# EAGLE design EarButton (EAGLE 6.4)
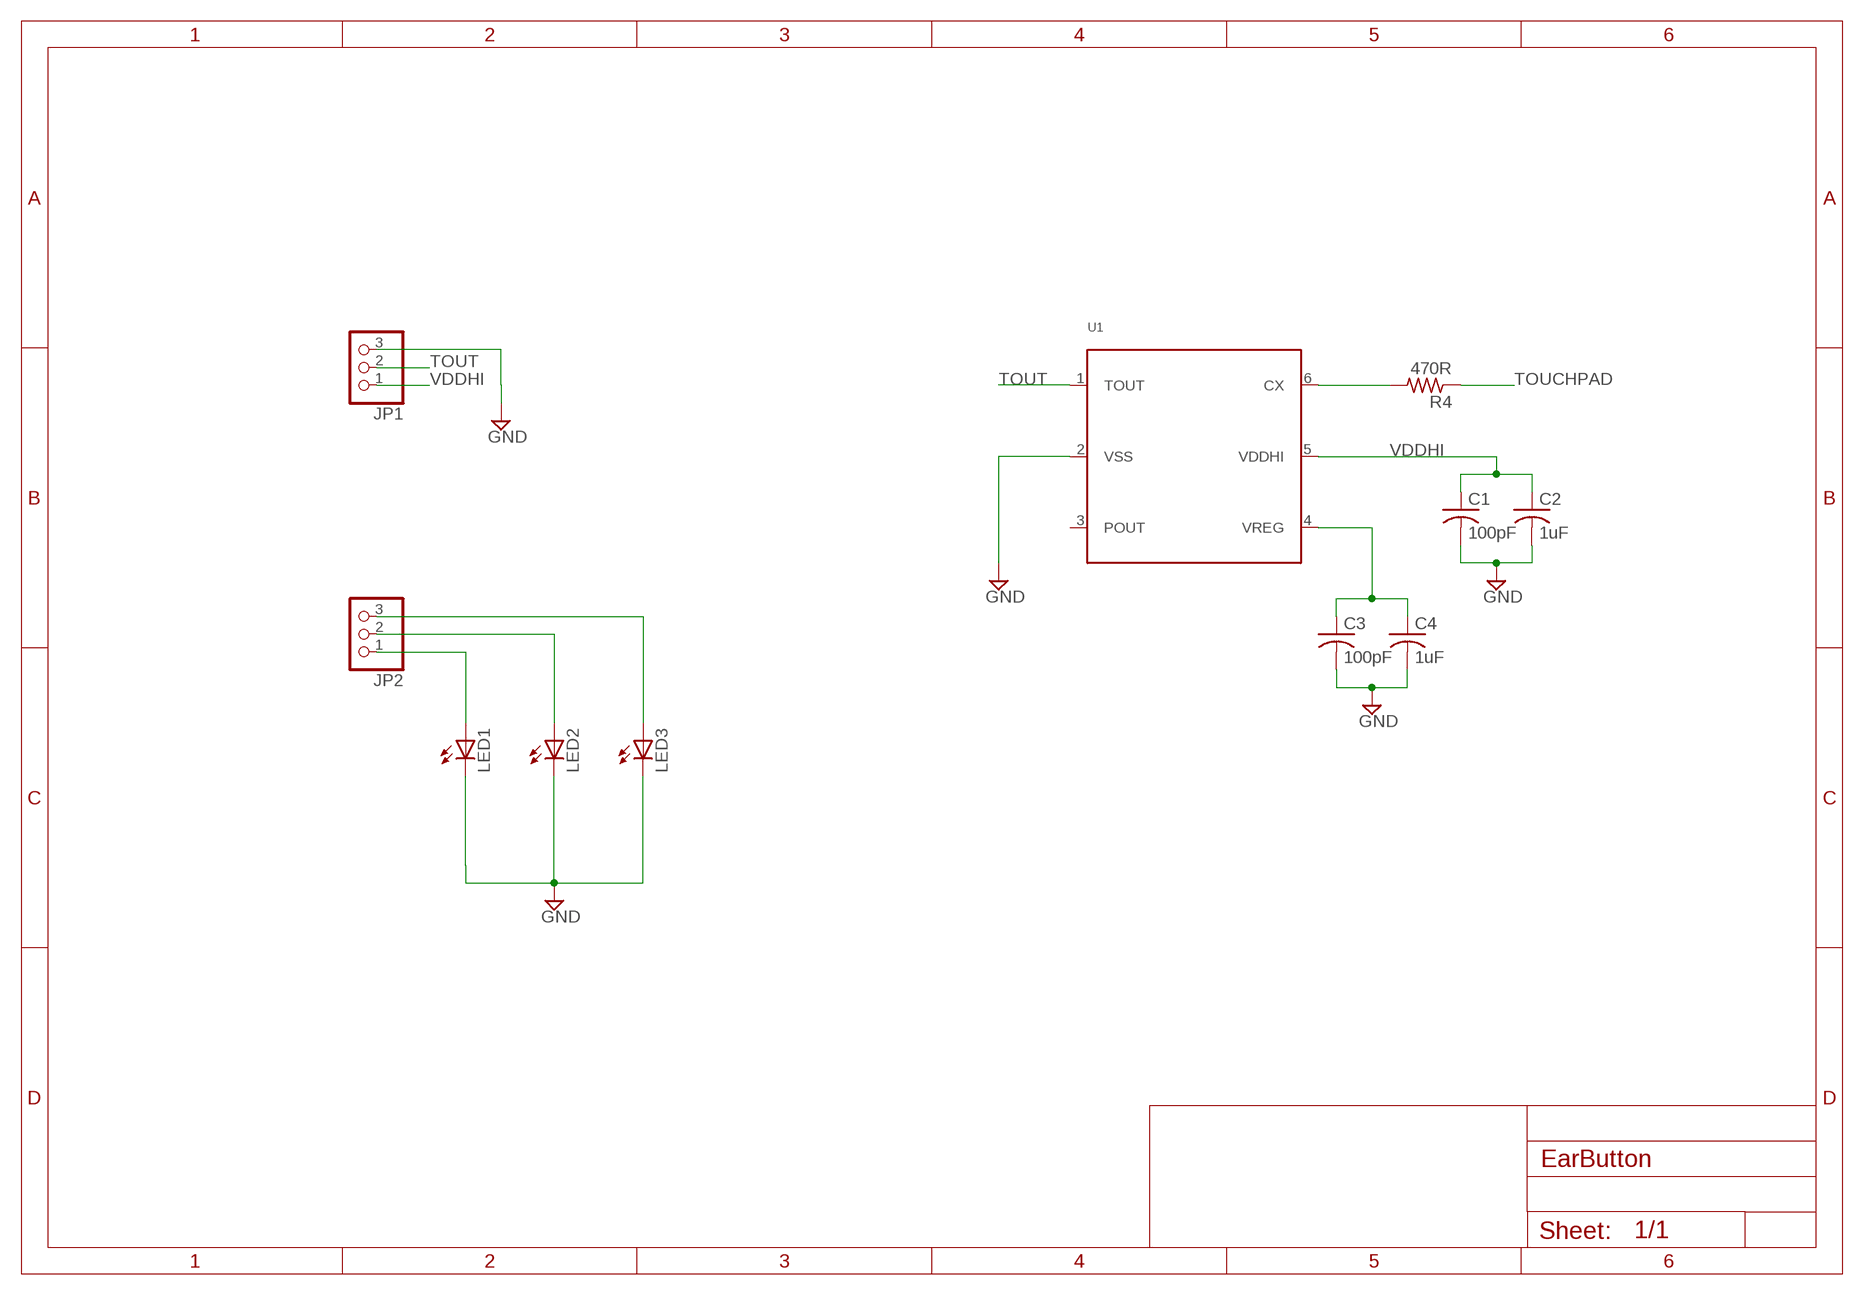
[diagram p0: schematic, sheet 1]

## Parts
C1  100pF  C-USC0603K  [C0603K]
C2  1uF  C-USC0603K  [C0603K]
C3  100pF  C-USC0603K  [C0603K]
C4  1uF  C-USC0603K  [C0603K]
JP1  PINHD-1X3  [1X03]
JP2  PINHD-1X3  [1X03]
LED1  LEDCHIPLED_1206  [CHIPLED_1206]
LED2  LEDCHIPLED_1206  [CHIPLED_1206]
LED3  LEDCHIPLED_1206  [CHIPLED_1206]
R4  470R  R-US_R0603  [R0603]
U1  IQS127  [SOT23-6]

## Nets
GND: C1.2 C2.2 C3.2 C4.2 JP1.3 LED1.C LED2.C LED3.C U1.2(VSS)
N$3: C3.1 C4.1 U1.4(VREG)
N$5: JP2.1 LED1.A
N$6: JP2.2 LED2.A
N$7: JP2.3 LED3.A
N$8: R4.2 U1.6(CX)
TOUCHPAD: R4.1
TOUT: JP1.2 U1.1(TOUT)
VDDHI: C1.1 C2.1 JP1.1 U1.5(VDDHI)
Unconnected: U1.3(POUT)

## Library data of the parts
C1-C4 = adafruit:C-US: CAPACITOR, American symbol
JP1 JP2 = adafruit:PINHD-1X3: PIN HEADER
LED1-LED3 = adafruit:LED: LED OSRAM: - CHIPLED LG R971, LG N971, LY N971, LG Q971, LY Q971, LO R971, LY R971 LH N974, LH R974 LS Q976, LO Q976, LY Q976 LO Q996 - Hyper CHIPLED LW Q18S LB Q993, LB Q99A, LB R99A - SideLED LS A670, LO A670, LY A670, LG A670, LP A670 LB A673, LV A673, LT A673, LW A673 LH A674 LY A675 LS A676, LA A676, LO A676, LY A676, LW A676 LS A679, LY A679, LG A679 - Hyper Micro SIDELED® LS Y876, LA Y876, LO Y876, LY Y876 LT Y87S - SmartLED LW L88C, LW L88S LB L89C, LB L89S, LG L890 LS L89K, LO L89K, LY L89K LS L896, LA L896, LO L896, LY L896 - TOPLED LS T670, LO T670, LY T670, LG T670, LP T670 LSG T670, LSP T670, LSY T670, LOP T670, LYG T670 LG T671, LOG T671, LSG T671 LB T673, LV T673, LT T673, LW T673 LH T674 LS T676, LA T676, LO T676, LY T676, LB T676, LH T676, LSB T676, LW T676 LB T67C, LV T67C, LT T67C, LS T67K, LO T67K, LY T67K, LW E67C LS E67B, LA E67B, LO E67B, LY E67B, LB E67C, LV E67C, LT E67C LW T67C LS T679, LY T679, LG T679 LS T770, LO T770, LY T770, LG T770, LP T770 LB T773, LV T773, LT T773, LW T773 LH T774 LS E675, LA E675, LY E675, LS T675 LS T776, LA T776, LO T776, LY T776, LB T776 LHGB T686 LT T68C, LB T68C - Hyper Mini TOPLED® LB M676 - Mini TOPLED Santana® LG M470 LS M47K, LO M47K, LY M47K Source: http://www.osram.convergy.de/
R4 = adafruit:R-US_: RESISTOR, American symbol
U1 = soulysolar:IQS127: IQS-127 Capacitive Touch Sensor Operating temperature - 40°C to 85°C Supply Voltage (VDDHI–VSS) 2.95 - 5V Mouser: 957-IQS127D00000TSR

## Board
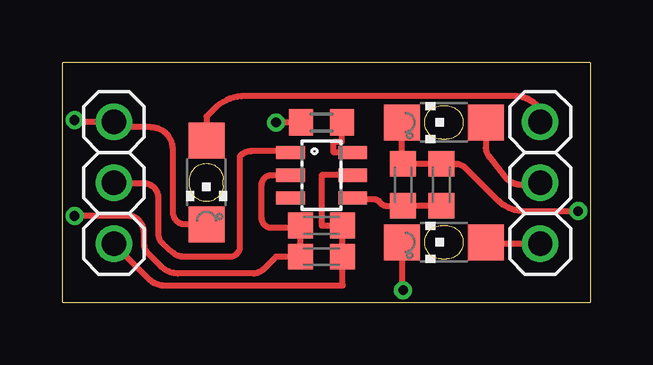
[diagram p1: board, top side]
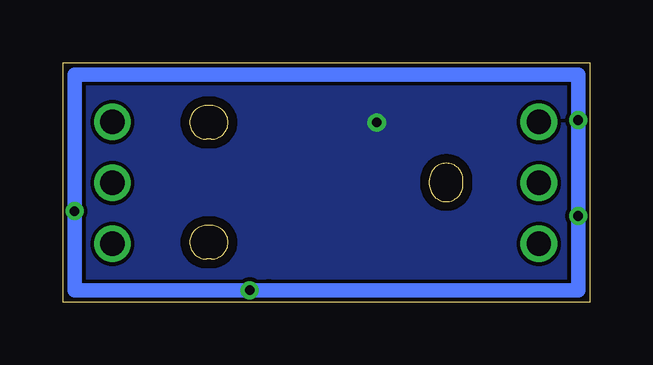
[diagram p2: board, bottom side, seen from below]

Size 22 x 10 mm. Coordinates in mm from the lower left corner, seen from the top.
Outline: 0,0 22,0 22,10 0,10 0,0
Outline: 15.8,6.8 arc-180 15.8,8.2 16,8.2 arc-180 16,6.8 15.8,6.8
Outline: 6.7,4.9 arc-180 5.3,4.9 5.3,5.1 arc-180 6.7,5.1 6.7,4.9
Outline: 15.8,1.8 arc-180 15.8,3.2 16,3.2 arc-180 16,1.8 15.8,1.8
Copper layers (1*16): Top 0.0356mm / dielectric 1.5011mm / Bottom 0.0356mm
Design rules "LaenPCBOrder": minimum track width 6mil, minimum drill 13mil, track to track 6mil, track to pad 6mil, pad to pad 6mil, via to via 6mil, smd to smd 6mil, copper to edge 15mil, drill to drill 6mil, minimum pad ring 7mil, minimum via ring 7mil, stop-mask expansion 4mil, vias tented up to drill 0mil, thermal gap 10mil

### Footprints (pad centres in the part's own frame; a part is rotated, then mirrored left to right if it is on the bottom)
C0603K = smd 1.05 x 1.08: 1 -0.875,0; 2 0.875,0
1X03 = drill 1.016: 1 -2.54,0; 2 0,0; 3 2.54,0
CHIPLED_1206 = smd 1.5 x 1.5: A 0,-1.75; C 0,1.75
R0603 = smd 1 x 1.1: 1 -0.85,0; 2 0.85,0
SOT23-6 = smd 0.55 x 1.2: 1 -0.95,-1.3; 2 0,-1.3; 3 0.95,-1.3; 4 0.95,1.3; 5 0,1.3; 6 -0.95,1.3

### Placement (x,y rotation side)
C1  10.8,1.9 180 top
C2  10.8,3.2 180 top
C3  14.2,4.9 90 top
C4  15.8,4.9 90 top
JP1  2.14,4.98 90 top
JP2  19.92,4.98 90 top
LED1  15.9,2.5 90 top
LED2  15.9,7.5 90 top
LED3  6,5 180 top
R4  10.8,7.5 0 top
U1  10.8,5.3 270 top

### Tracks (layer width: path | path; a pad name or v marks a point on that pad's centre or on a via)
GND  (via drill 0.4 pad 0.25)
  Top 0.254: 14.2,2.95 LED1.C 14.15,0.65 v14.2,0.5 | U1.2 8.7,5.3 arc90 8.3,4.9 8.3,3.51 arc90 8.71,3.1 9.82,3.1 C2.2 C1.2 8.9,1.9 8.38,1.38 arc-45 7.95,1.2 4.82,1.2 arc-45 4.11,1.49 3.55,2.05 arc-45 3.4,2.41 3.4,2.86 arc45 3.16,3.44 3.15,3.45 arc45 2.79,3.6 v0.5,3.6 | LED2.C 14.15,5.83 C3.2 C4.2 16.39,5.78 arc-45 16.79,5.61 18.1,4.3 arc45 19.31,3.8 v21.5,3.8 | LED3.C 5.07,3.25 arc-36 4.85,3.32 4.83,3.34 arc-54 4.6,3.78 4.6,6.38 arc90 3.68,7.3 2.36,7.3 JP1.3 0.5,7.52 v0.5,7.6
  Bottom 0.254: v21.5,3.8 21.5,4.3
  Bottom 0.61: 0.5,9.5 21.5,9.5 21.5,4.3 v21.5,3.8 21.5,0.5 v14.2,0.5 13.4,0.5 0.5,0.5 v0.5,3.6 0.5,3.8 0.5,5.1 0.5,5.3 0.5,7.1 0.5,7.4 v0.5,7.6 0.5,7.7 0.5,9.5
N$3
  Top 0.254: C4.1 C3.1 13.49,4.03 arc-45 13.29,4.11 13.19,4.21 arc45 12.97,4.3 12.15,4.3 U1.4
N$5
  Top 0.254: JP2.1 17.31,2.44 LED1.A
N$6
  Top 0.254: LED2.A 17.65,6.45 arc38 17.77,6.1 18.41,5.27 arc52 19.16,4.9 19.84,4.9 JP2.2
N$7
  Top 0.254: JP2.3 19.92,7.93 arc45 19.81,8.19 arc45 18.81,8.6 7.6,8.6 arc45 6.32,8.07 6,7.75 LED3.A
N$8
  Top 0.254: U1.6 11.3,6.25 11.3,6.7 11.65,6.7 R4.2
TOUCHPAD  (via drill 0.4 pad 0.25)
  Top 0.254: R4.1 v8.9,7.5
  pour Bottom: 0.9,9.1 21.1,9.1 21.1,0.9 0.9,0.9
TOUT
  Top 0.254: U1.1 9.45,6.3 7.87,6.3 arc45 7.41,6.11 arc45 7.4,6.08 7.4,2.32 arc-90 6.98,1.9 5.04,1.9 arc-41 4.62,2.06 4.17,2.45 arc-49 4,2.83 4,4.34 arc90 3.38,4.96 2.16,4.96 JP1.2
VDDHI
  Top 0.254: U1.5 10.8,5.3 10.8,3.2 C2.1 C1.1 11.68,0.72 arc-135 11.66,0.7 4.19,0.7 arc-45 3.66,0.92 JP1.1